# EAGLE schematic sch (EAGLE 7.2.0)
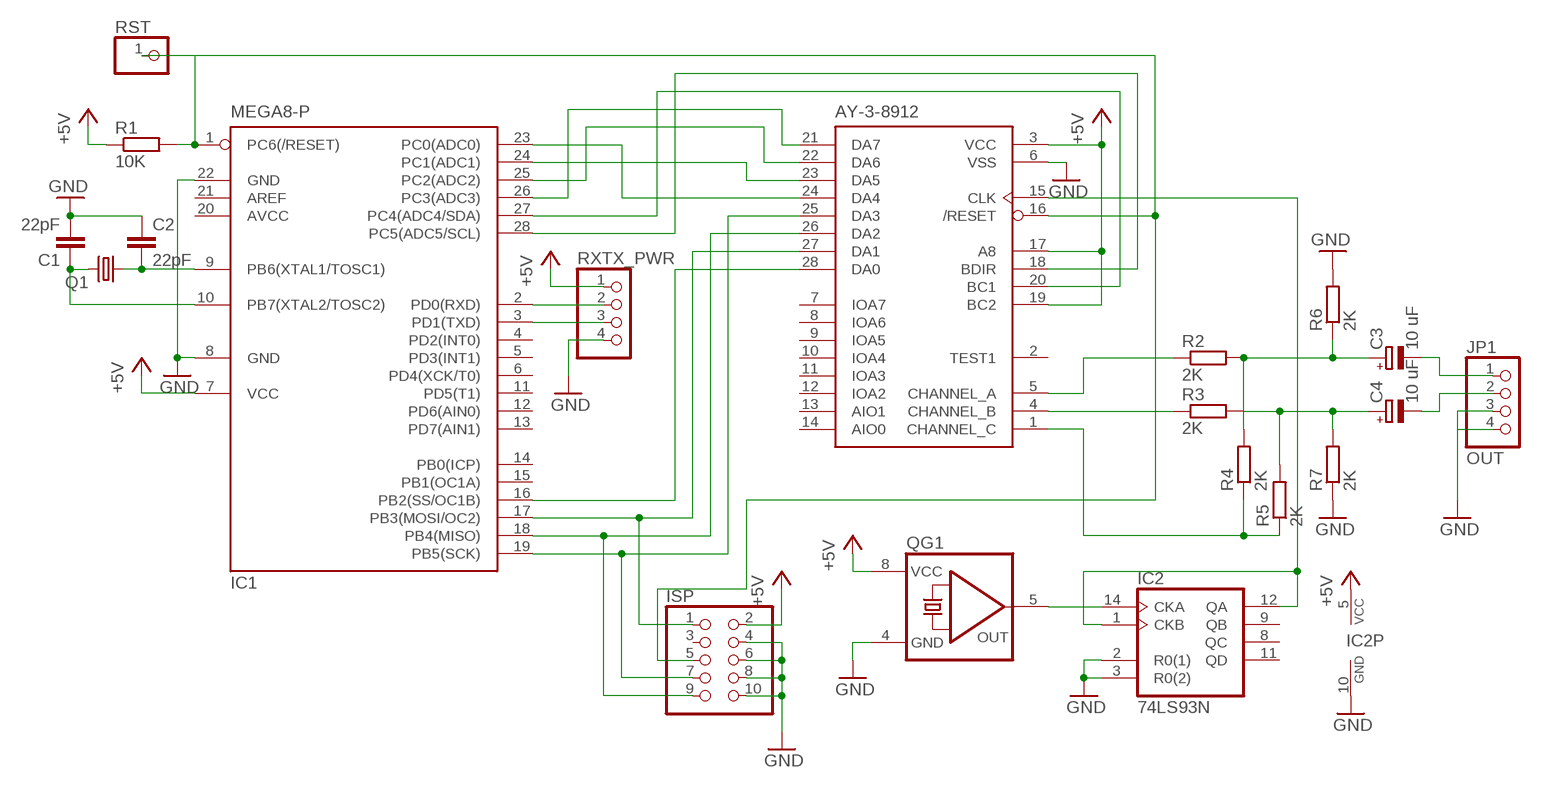
[diagram p0: schematic, sheet 1]

## Parts
AY-3-8912  AY-3-8912_28PIN  [DIL28]
C1  22pF  C2,5-3  [C2.5-3]
C2  22pF  C2,5-3  [C2.5-3]
C3  10 uF  CPOL-EUE2,5-6E  [E2,5-6E]
C4  10 uF  CPOL-EUE2,5-6E  [E2,5-6E]
IC1  MEGA8-P  [DIL28-3]
IC2  74LS93N  [DIL14]
ISP  PINHD-2X5  [2X05]
JP1  OUT  PINHD-1X4  [1X04]
Q1  CRYSTALHC49U-V  [HC49U-V]
QG1  QG5460  [DIL08S]
R1  10K  R-EU_0204/7  [0204/7]
R2  2K  R-EU_0204/7  [0204/7]
R3  2K  R-EU_0204/7  [0204/7]
R4  2K  R-EU_0204/7  [0204/7]
R5  2K  R-EU_0204/7  [0204/7]
R6  2K  R-EU_0204/7  [0204/7]
R7  2K  R-EU_0204/7  [0204/7]
RST  PINHD-1X1  [1X01]
RXTX_PWR  PINHD-1X4  [1X04]

## Nets
+5V: AY-3-8912.3(VCC) AY-3-8912.17(A8) AY-3-8912.19(BC2) IC1.7(VCC) IC2.5(VCC) ISP.2 QG1.8(VCC) R1.1 RXTX_PWR.1
GND: AY-3-8912.6(VSS) C1.2 C2.1 IC1.8(GND) IC1.22(GND) IC2.2(R0(1)) IC2.3(R0(2)) IC2.10(GND) ISP.4 ISP.6 ISP.8 ISP.10 JP1.3 JP1.4 QG1.4(GND) R6.2 R7.1 RXTX_PWR.4
N$1: AY-3-8912.24(DA4) IC1.23(PC0(ADC0))
N$2: AY-3-8912.23(DA5) IC1.24(PC1(ADC1))
N$3: AY-3-8912.22(DA6) IC1.25(PC2(ADC2))
N$4: AY-3-8912.21(DA7) IC1.26(PC3(ADC3))
N$5: AY-3-8912.28(DA0) IC1.16(PB2(SS/OC1B))
N$6: AY-3-8912.27(DA1) IC1.17(PB3(MOSI/OC2)) ISP.1
N$7: AY-3-8912.26(DA2) IC1.18(PB4(MISO)) ISP.9
N$8: AY-3-8912.25(DA3) IC1.19(PB5(SCK)) ISP.7
N$9: AY-3-8912.20(BC1) IC1.27(PC4(ADC4/SDA))
N$10: AY-3-8912.18(BDIR) IC1.28(PC5(ADC5/SCL))
N$11: AY-3-8912.16(/RESET) IC1.1(PC6(/RESET)) ISP.5 R1.2 RST.1
N$12: C2.2 IC1.9(PB6(XTAL1/TOSC1)) Q1.1
N$13: C1.1 IC1.10(PB7(XTAL2/TOSC2)) Q1.2
N$14: IC2.14(CKA) QG1.5(OUT)
N$15: AY-3-8912.5(CHANNEL_A) R2.1
N$16: AY-3-8912.15(CLK) IC2.1(CKB) IC2.12(QA)
N$17: IC1.2(PD0(RXD)) RXTX_PWR.2
N$18: IC1.3(PD1(TXD)) RXTX_PWR.3
N$19: AY-3-8912.4(CHANNEL_B) R3.1
N$20: C3.+ R2.2 R4.2 R6.1
N$21: C4.+ R3.2 R5.2 R7.2
N$22: AY-3-8912.1(CHANNEL_C) R4.1 R5.1
N$23: C3.- JP1.1
N$24: C4.- JP1.2
Unconnected: AY-3-8912.2(TEST1) AY-3-8912.7(IOA7) AY-3-8912.8(IOA6) AY-3-8912.9(IOA5) AY-3-8912.10(IOA4) AY-3-8912.11(IOA3) AY-3-8912.12(IOA2) AY-3-8912.13(AIO1) AY-3-8912.14(AIO0) IC1.4(PD2(INT0)) IC1.5(PD3(INT1)) IC1.6(PD4(XCK/T0)) IC1.11(PD5(T1)) IC1.12(PD6(AIN0)) IC1.13(PD7(AIN1)) IC1.14(PB0(ICP)) IC1.15(PB1(OC1A)) IC1.21(AREF) IC2.8(QC) IC2.9(QB) IC2.11(QD) ISP.3

## Power pins joined to a net without a drawn wire
AVCC: IC1.20(AVCC)

## Library data of the parts
AY-3-8912 = 8Bit_Parts:AY-3-8912_28PIN
C1 C2 = capacitor-wima:C: CAPACITOR naming: grid - package width
C3 C4 = rcl:CPOL-EU: POLARIZED CAPACITOR, European symbol
IC1 = atmel:MEGA8-P: MICROCONTROLLER 8 Kbytes FLASH, 1 kbytes SRAM, 512 bytes EEPROM, USART, 4-channel 10 bit ADC, 2-channel 8 bit ADC Pin compatible with Atmega48, ATMega88, ATMega168 Source: avr.lbr; OC_FARNELL: unknown; OC_NEWARK: unknown
IC2 = 74xx-eu:74*93: Decade, divide by twelve and binary COUNTER
ISP = pinhead:PINHD-2X5: PIN HEADER
JP1 RXTX_PWR = pinhead:PINHD-1X4: PIN HEADER
Q1 = crystal:CRYSTAL: CRYSTAL; OC_FARNELL: 1666969; OC_NEWARK: unknown
QG1 = crystal:QG5460: CRYSTAL RESONATOR; OC_FARNELL: unknown; OC_NEWARK: unknown
R1-R7 = rcl:R-EU_: RESISTOR, European symbol
RST = pinhead:PINHD-1X1: PIN HEADER